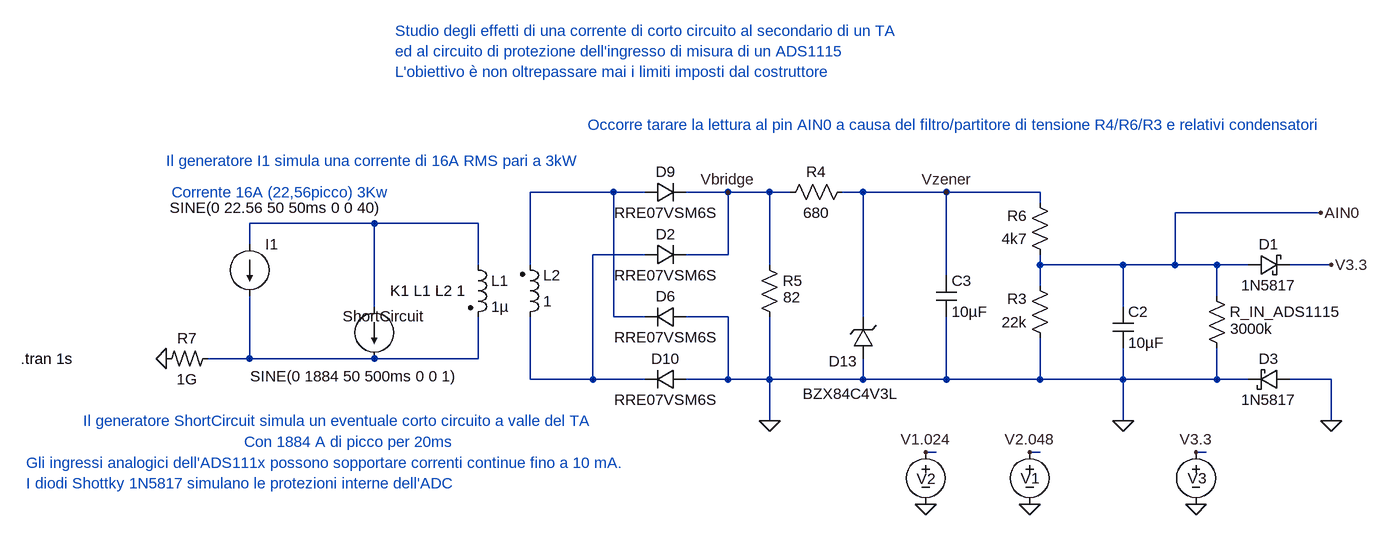
[diagram p0: schematic TrAmp-Bridge-Studio.asc]
TrAmp-Bridge-Studio.asc, the LTspice schematic file:
Version 4
SHEET 1 2288 680
WIRE 624 -320 496 -320
WIRE 672 -320 624 -320
WIRE 800 -320 736 -320
WIRE 864 -320 800 -320
WIRE 896 -320 864 -320
WIRE 1008 -320 976 -320
WIRE 1136 -320 1008 -320
WIRE 1280 -320 1136 -320
WIRE 1280 -304 1280 -320
WIRE 1712 -288 1488 -288
WIRE 256 -272 64 -272
WIRE 416 -272 256 -272
WIRE 64 -240 64 -272
WIRE 672 -224 592 -224
WIRE 800 -224 800 -320
WIRE 800 -224 736 -224
WIRE 416 -208 416 -272
WIRE 496 -208 496 -320
WIRE 864 -208 864 -320
WIRE 1280 -208 1280 -224
WIRE 1408 -208 1280 -208
WIRE 1488 -208 1488 -288
WIRE 1488 -208 1408 -208
WIRE 1552 -208 1488 -208
WIRE 1600 -208 1552 -208
WIRE 1728 -208 1664 -208
WIRE 1136 -192 1136 -320
WIRE 1280 -176 1280 -208
WIRE 1552 -160 1552 -208
WIRE 256 -144 256 -272
WIRE 1408 -144 1408 -208
WIRE 624 -128 624 -320
WIRE 672 -128 624 -128
WIRE 800 -128 736 -128
WIRE 1008 -128 1008 -320
WIRE 64 -64 64 -160
WIRE 64 -64 0 -64
WIRE 256 -64 64 -64
WIRE 416 -64 416 -128
WIRE 416 -64 256 -64
WIRE 496 -32 496 -128
WIRE 592 -32 592 -224
WIRE 592 -32 496 -32
WIRE 672 -32 592 -32
WIRE 800 -32 800 -128
WIRE 800 -32 736 -32
WIRE 864 -32 864 -128
WIRE 864 -32 800 -32
WIRE 1008 -32 1008 -64
WIRE 1008 -32 864 -32
WIRE 1136 -32 1136 -128
WIRE 1136 -32 1008 -32
WIRE 1280 -32 1280 -96
WIRE 1280 -32 1136 -32
WIRE 1408 -32 1408 -80
WIRE 1408 -32 1280 -32
WIRE 1552 -32 1552 -80
WIRE 1552 -32 1408 -32
WIRE 1600 -32 1552 -32
WIRE 1728 -32 1664 -32
WIRE 864 32 864 -32
WIRE 1408 32 1408 -32
WIRE 1728 32 1728 -32
WIRE 1120 80 1104 80
WIRE 1280 80 1264 80
WIRE 1536 80 1520 80
FLAG -64 -64 0
FLAG 1712 -288 AIN0
FLAG 864 32 0
FLAG 1408 32 0
FLAG 1264 160 0
FLAG 1104 160 0
FLAG 1728 32 0
FLAG 1520 160 0
FLAG 1728 -208 V3.3
FLAG 1520 80 V3.3
FLAG 1264 80 V2.048
FLAG 1104 80 V1.024
FLAG 1136 -320 Vzener
FLAG 800 -320 Vbridge
SYMBOL res 848 -224 R0
WINDOW 3 37 66 Left 2
SYMATTR Value 82
SYMATTR InstName R5
SYMBOL ind2 400 -224 R0
SYMATTR InstName L1
SYMATTR Value 1µ
SYMATTR Type ind
SYMATTR SpiceLine Rser=1u
SYMBOL ind2 480 -112 M180
WINDOW 0 36 80 Left 2
WINDOW 3 36 40 Left 2
SYMATTR InstName L2
SYMATTR Value 1
SYMATTR Type ind
SYMATTR SpiceLine Rser=47 Cpar=300pF
SYMBOL res2 0 -80 R90
WINDOW 0 0 32 VBottom 2
WINDOW 3 32 32 VTop 2
SYMATTR InstName R7
SYMATTR Value 1G
SYMBOL res 992 -336 R90
WINDOW 0 0 56 VBottom 2
WINDOW 3 32 56 VTop 2
SYMATTR InstName R4
SYMATTR Value 680
SYMBOL current 64 -240 R0
WINDOW 123 0 0 Left 0
WINDOW 39 0 0 Left 0
WINDOW 3 -123 -56 Left 2
SYMATTR Value SINE(0 22.56 50 50ms 0 0 40)
SYMATTR InstName I1
SYMBOL current 256 -144 R0
WINDOW 3 -191 107 Left 2
WINDOW 123 0 0 Left 0
WINDOW 39 0 0 Left 0
WINDOW 0 -49 15 Left 2
SYMATTR Value SINE(0 1884 50 500ms 0 0 1)
SYMATTR InstName ShortCircuit
SYMBOL diode 672 -304 R270
WINDOW 0 32 32 VTop 2
WINDOW 3 0 32 VBottom 2
SYMATTR InstName D9
SYMATTR Value RRE07VSM6S
SYMBOL cap 1392 -144 R0
SYMATTR InstName C2
SYMATTR Value 10µF
SYMBOL res 1296 -208 R180
WINDOW 0 36 76 Left 2
WINDOW 3 36 40 Left 2
SYMATTR InstName R6
SYMATTR Value 4k7
SYMBOL zener 1024 -64 R180
WINDOW 0 25 -4 Left 2
WINDOW 3 -38 -54 Left 2
SYMATTR InstName D13
SYMATTR Value BZX84C4V3L
SYMATTR Description Diode
SYMATTR Type diode
SYMBOL res 1536 -176 R0
WINDOW 3 37 66 Left 2
SYMATTR Value 3000k
SYMATTR InstName R_IN_ADS1115
SYMBOL res 1296 -80 R180
WINDOW 0 36 76 Left 2
WINDOW 3 36 40 Left 2
SYMATTR InstName R3
SYMATTR Value 22k
SYMBOL cap 1120 -192 R0
SYMATTR InstName C3
SYMATTR Value 10µF
SYMBOL diode 672 -208 R270
WINDOW 0 32 32 VTop 2
WINDOW 3 0 32 VBottom 2
SYMATTR InstName D2
SYMATTR Value RRE07VSM6S
SYMBOL diode 736 -144 R90
WINDOW 0 0 32 VBottom 2
WINDOW 3 32 32 VTop 2
SYMATTR InstName D6
SYMATTR Value RRE07VSM6S
SYMBOL diode 736 -48 R90
WINDOW 0 0 32 VBottom 2
WINDOW 3 32 32 VTop 2
SYMATTR InstName D10
SYMATTR Value RRE07VSM6S
SYMBOL voltage 1264 64 R0
WINDOW 123 0 0 Left 0
WINDOW 39 0 0 Left 0
WINDOW 0 -14 56 Left 2
WINDOW 3 24 96 Invisible 2
SYMATTR InstName V1
SYMATTR Value 2.048
SYMBOL voltage 1104 64 R0
WINDOW 123 0 0 Left 0
WINDOW 39 0 0 Left 0
WINDOW 0 -14 57 Left 2
WINDOW 3 24 96 Invisible 2
SYMATTR InstName V2
SYMATTR Value 1.024
SYMBOL schottky 1600 -192 R270
WINDOW 0 32 32 VTop 2
WINDOW 3 0 32 VBottom 2
SYMATTR InstName D1
SYMATTR Value 1N5817
SYMATTR Description Diode
SYMATTR Type diode
SYMBOL schottky 1664 -48 R90
WINDOW 0 0 32 VBottom 2
WINDOW 3 32 32 VTop 2
SYMATTR InstName D3
SYMATTR Value 1N5817
SYMATTR Description Diode
SYMATTR Type diode
SYMBOL voltage 1520 64 R0
WINDOW 123 0 0 Left 0
WINDOW 39 0 0 Left 0
WINDOW 0 -13 56 Left 2
WINDOW 3 24 96 Invisible 2
SYMATTR InstName V3
SYMATTR Value 3.3
TEXT -288 -64 Left 2 !.tran 1s
TEXT 280 -168 Left 2 !K1 L1 L2 1
TEXT -56 -320 Left 2 ;Corrente 16A (22,56picco) 3Kw
TEXT -280 128 Left 2 ;I diodi Shottky 1N5817 simulano le protezioni interne dell'ADC
TEXT -192 32 Left 2 ;Il generatore ShortCircuit simula un eventuale corto circuito a valle del TA
TEXT -280 96 Left 2 ;Gli ingressi analogici dell'ADS111x possono sopportare correnti continue fino a 10 mA.
TEXT 56 64 Left 2 ;Con 1884 A di picco per 20ms
TEXT 288 -568 Left 2 ;Studio degli effetti di una corrente di corto circuito al secondario di un TA \ned al circuito di protezione dell'ingresso di misura di un ADS1115\nL'obiettivo è non oltrepassare mai i limiti imposti dal costruttore
TEXT -64 -368 Left 2 ;Il generatore I1 simula una corrente di 16A RMS pari a 3kW
TEXT 584 -424 Left 2 ;Occorre tarare la lettura al pin AIN0 a causa del filtro/partitore di tensione R4/R6/R3 e relativi condensatori

The netlist it stands for:
* TrAmp-Bridge-Studio.asc
R5 Vbridge 0 82
L1 N002 N004 1µ Rser=1u
L2 N003 N001 1 Rser=47 Cpar=300pF
R7 N004 0 1G
R4 Vzener Vbridge 680
I1 N002 N004 SINE(0 22.56 50 50ms 0 0 40)
I§ShortCircuit N002 N004 SINE(0 1884 50 500ms 0 0 1)
D9 N001 Vbridge RRE07VSM6S
C2 AIN0 0 10µF
R6 AIN0 Vzener 4k7
D13 0 Vzener BZX84C4V3L
R_IN_ADS1115 AIN0 0 3000k
R3 0 AIN0 22k
C3 Vzener 0 10µF
D2 N003 Vbridge RRE07VSM6S
D6 0 N001 RRE07VSM6S
D10 0 N003 RRE07VSM6S
V1 V2.048 0 2.048
V2 V1.024 0 1.024
D1 AIN0 V3.3 1N5817
D3 0 0 1N5817
V3 V3.3 0 3.3
.model D D
.lib standard.dio
.tran 1s
K1 L1 L2 1
* Corrente 16A (22,56picco) 3Kw
* I diodi Shottky 1N5817 simulano le protezioni interne dell'ADC
* Il generatore ShortCircuit simula un eventuale corto circuito a valle del TA
* Gli ingressi analogici dell'ADS111x possono sopportare correnti continue fino a 10 mA.
* Con 1884 A di picco per 20ms
* Studio degli effetti di una corrente di corto circuito al secondario di un TA
* ed al circuito di protezione dell'ingresso di misura di un ADS1115
* L'obiettivo è non oltrepassare mai i limiti imposti dal costruttore
* Il generatore I1 simula una corrente di 16A RMS pari a 3kW
* Occorre tarare la lettura al pin AIN0 a causa del filtro/partitore di tensione R4/R6/R3 e relativi condensatori
.backanno
.end